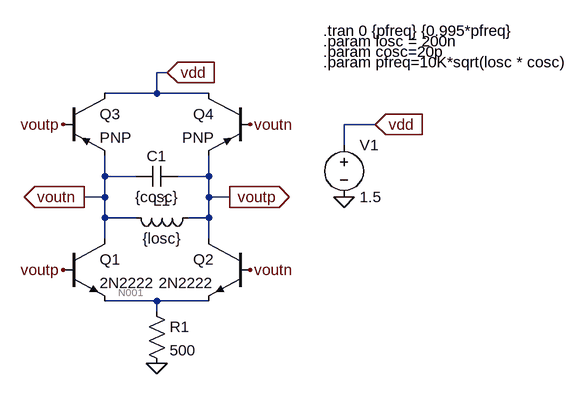
[diagram p0: schematic osc.asc]
osc.asc, the LTspice schematic file:
Version 4
SHEET 1 1004 680
WIRE 496 -48 480 -48
WIRE 480 -16 480 -48
WIRE 480 -16 400 -16
WIRE 560 -16 480 -16
WIRE 816 32 768 32
WIRE 768 64 768 32
WIRE 400 112 400 80
WIRE 448 112 400 112
WIRE 560 112 560 80
WIRE 560 112 512 112
WIRE 400 144 400 112
WIRE 400 144 368 144
WIRE 560 144 560 112
WIRE 592 144 560 144
WIRE 400 176 400 144
WIRE 448 176 400 176
WIRE 560 176 560 144
WIRE 560 176 528 176
WIRE 400 208 400 176
WIRE 560 208 560 176
WIRE 480 304 400 304
WIRE 560 304 480 304
WIRE 480 320 480 304
FLAG 624 256 voutn
FLAG 336 256 voutp
FLAG 368 144 voutn
IOPIN 368 144 Out
FLAG 592 144 voutp
IOPIN 592 144 Out
FLAG 496 -48 vdd
IOPIN 496 -48 In
FLAG 816 32 vdd
IOPIN 816 32 In
FLAG 768 144 0
FLAG 480 400 0
FLAG 336 32 voutp
FLAG 624 32 voutn
DATAFLAG 400 112 "$-V(voutp)"
SYMBOL npn 336 208 R0
SYMATTR InstName Q1
SYMATTR Value 2N2222
SYMBOL npn 624 208 M0
SYMATTR InstName Q2
SYMATTR Value 2N2222
SYMBOL ind 544 160 R90
WINDOW 0 5 56 VBottom 2
WINDOW 3 32 56 VTop 2
SYMATTR InstName L1
SYMATTR Value {losc}
SYMATTR SpiceLine Rser=1
SYMBOL cap 512 96 R90
WINDOW 0 0 32 VBottom 2
WINDOW 3 32 32 VTop 2
SYMATTR InstName C1
SYMATTR Value {cosc}
SYMBOL voltage 768 48 R0
WINDOW 123 0 0 Left 0
WINDOW 39 0 0 Left 0
SYMATTR InstName V1
SYMATTR Value 1.5
SYMBOL pnp 336 -16 R0
SYMATTR InstName Q3
SYMBOL pnp 624 -16 M0
SYMATTR InstName Q4
SYMBOL res 464 304 R0
SYMATTR InstName R1
SYMATTR Value 500
TEXT 736 -96 Left 2 !.param losc = 200n
TEXT 736 -80 Left 2 !.param cosc=20p
TEXT 736 -112 Left 2 !.tran 0 {pfreq} {0.995*pfreq}
TEXT 736 -64 Left 2 !.param pfreq=10K*sqrt(losc * cosc)

The netlist it stands for:
* osc.asc
Q1 voutn voutp N001 0 2N2222
Q2 voutp voutn N001 0 2N2222
L1 voutp voutn {losc} Rser=1
C1 voutp voutn {cosc}
V1 vdd 0 1.5
Q3 vdd voutp voutn 0 PNP
Q4 vdd voutn voutp 0 PNP
R1 N001 0 500
.model NPN NPN
.model PNP PNP
.lib standard.bjt
.param losc = 200n
.param cosc=20p
.tran 0 {pfreq} {0.995*pfreq}
.param pfreq=10K*sqrt(losc * cosc)
.backanno
.end

* Results of the author's LTspice run, read from the files saved beside the schematic
* Operating Point, zero values left out:
*   V(voutn) = 788.3 mV
*   V(voutp) = 788.3 mV
*   V(n001) = 177.9 mV
*   V(vdd) = 1.5 V
*   Ic(Q1) = 177.1 µA
*   Ib(Q1) = 885.8 nA
*   Ie(Q1) = -177.9 µA
*   Ic(Q2) = 177.1 µA
*   Ib(Q2) = 885.8 nA
*   Ie(Q2) = -177.9 µA
*   Ic(Q3) = 177.9 µA
*   Ib(Q3) = -88.97 µA
*   Ie(Q3) = -88.97 µA
*   Ic(Q4) = 177.9 µA
*   Ib(Q4) = -88.97 µA
*   Ie(Q4) = -88.97 µA
*   I(R1) = 355.9 µA
*   I(V1) = -355.9 µA
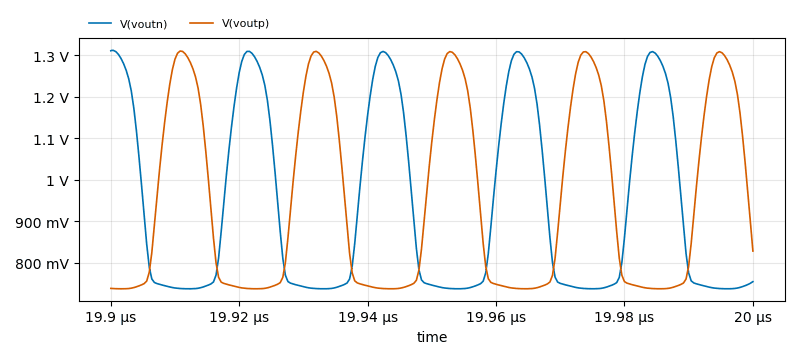
[diagram p1: Transient Analysis of osc.asc, plotted from the saved traces]
* Transient Analysis, 1 run:
*   V(voutn): min 737.7 mV, max 1.312 V, average 930 mV, rms 956.9 mV, last 755 mV
*   V(voutp): min 737.7 mV, max 1.311 V, average 945.1 mV, rms 971.9 mV, last 828.7 mV